# EAGLE schematic msgeq7-simple (EAGLE 6.5.0)
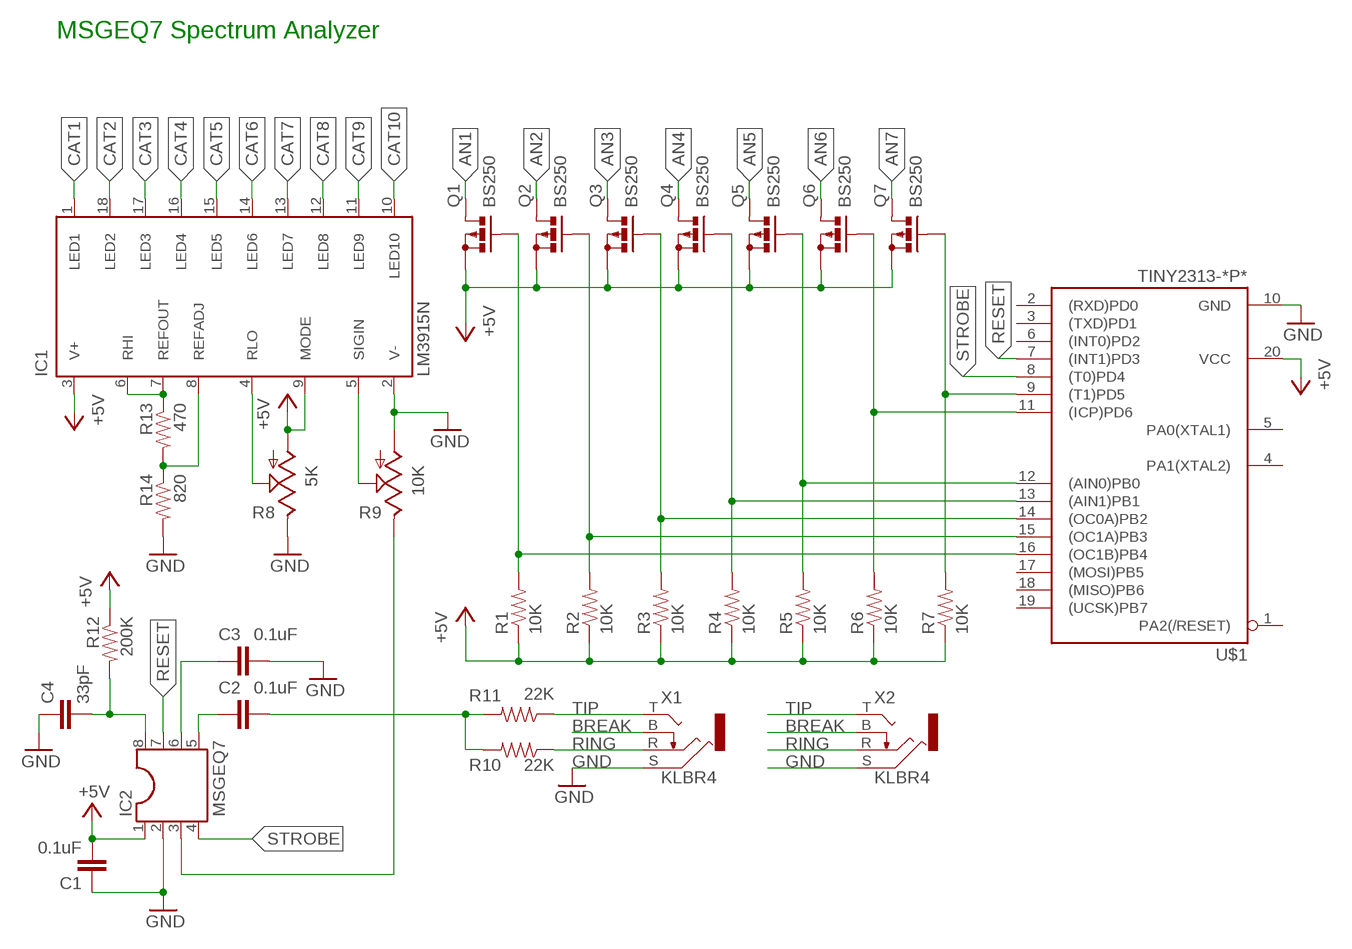
[diagram p0: schematic, sheet 1]

## Parts
C1  0.1uF  CAPPTH  [CAP-PTH-SMALL]
C2  0.1uF  CAPPTH  [CAP-PTH-SMALL]
C3  0.1uF  CAPPTH  [CAP-PTH-SMALL]
C4  33pF  CAPPTH  [CAP-PTH-SMALL]
IC1  LM3915N  [DIL18]
IC2  MSGEQ7  DIL8  [DIL08]
Q1  BS250  [SOT54E]
Q2  BS250  [SOT54E]
Q3  BS250  [SOT54E]
Q4  BS250  [SOT54E]
Q5  BS250  [SOT54E]
Q6  BS250  [SOT54E]
Q7  BS250  [SOT54E]
R1  10K  RESISTORPTH-1/4W  [AXIAL-0.4]
R2  10K  RESISTORPTH-1/4W  [AXIAL-0.4]
R3  10K  RESISTORPTH-1/4W  [AXIAL-0.4]
R4  10K  RESISTORPTH-1/4W  [AXIAL-0.4]
R5  10K  RESISTORPTH-1/4W  [AXIAL-0.4]
R6  10K  RESISTORPTH-1/4W  [AXIAL-0.4]
R7  10K  RESISTORPTH-1/4W  [AXIAL-0.4]
R8  5K  TRIM_US-LI10  [LI10]
R9  10K  TRIM_US-LI10  [LI10]
R10  22K  RESISTORPTH-1/4W  [AXIAL-0.4]
R11  22K  RESISTORPTH-1/4W  [AXIAL-0.4]
R12  200K  RESISTORPTH-1/4W  [AXIAL-0.4]
R13  470  RESISTORPTH-1/4W  [AXIAL-0.4]
R14  820  RESISTORPTH-1/4W  [AXIAL-0.4]
U$1  TINY2313-*P*  [DIL20]
X1  KLBR4  [KLBR4]
X2  KLBR4  [KLBR4]

## Nets
+5V: C1.2 IC1.3(V+) IC1.9(MODE) IC2.1 Q1.S Q2.S Q3.S Q4.S Q5.S Q6.S Q7.S R1.P$1 R2.P$1 R3.P$1 R4.P$1 R5.P$1 R6.P$1 R7.P$1 R8.A R12.P$1 U$1.20(VCC)
AN1: Q1.D
AN2: Q2.D
AN3: Q3.D
AN4: Q4.D
AN5: Q5.D
AN6: Q6.D
AN7: Q7.D
BREAK: X1.B X2.B
CAT1: IC1.1(LED1)
CAT2: IC1.18(LED2)
CAT3: IC1.17(LED3)
CAT4: IC1.16(LED4)
CAT5: IC1.15(LED5)
CAT6: IC1.14(LED6)
CAT7: IC1.13(LED7)
CAT8: IC1.12(LED8)
CAT9: IC1.11(LED9)
CAT10: IC1.10(LED10)
GND: C1.1 C3.1 C4.1 IC1.2(V-) IC2.2 R8.E R9.A R14.P$2 U$1.10(GND) X1.S X2.S
N$1: Q1.G R1.P$2 U$1.16((OC1B)PB4)
N$2: Q2.G R2.P$2 U$1.15((OC1A)PB3)
N$3: Q3.G R3.P$2 U$1.14((OC0A)PB2)
N$4: Q4.G R4.P$2 U$1.13((AIN1)PB1)
N$5: Q5.G R5.P$2 U$1.12((AIN0)PB0)
N$6: Q6.G R6.P$2 U$1.11((ICP)PD6)
N$7: Q7.G R7.P$2 U$1.9((T1)PD5)
N$9: IC1.4(RLO) R8.S
N$10: C2.2 IC2.5
N$11: IC2.3 R9.E
N$12: IC1.5(SIGIN) R9.S
N$13: C2.1 R10.P$2 R11.P$2
N$14: C3.2 IC2.6
N$15: C4.2 IC2.8 R12.P$2
N$16: IC1.6(RHI) IC1.7(REFOUT) R13.P$1
N$17: IC1.8(REFADJ) R13.P$2 R14.P$1
RESET: IC2.7 U$1.7((INT1)PD3)
RING: R10.P$1 X1.R X2.R
STROBE: IC2.4 U$1.8((T0)PD4)
TIP: R11.P$1 X1.T X2.T
Unconnected: U$1.1(PA2(/RESET)) U$1.2((RXD)PD0) U$1.3((TXD)PD1) U$1.4(PA1(XTAL2)) U$1.5(PA0(XTAL1)) U$1.6((INT0)PD2) U$1.17((MOSI)PB5) U$1.18((MISO)PB6) U$1.19((UCSK)PB7)

## Notes on the sheet
- MSGEQ7 Spectrum Analyzer

## Library data of the parts
C1-C4 = SparkFun-Capacitors:CAP: Capacitor Standard 0603 ceramic capacitor, and 0.1" leaded capacitor.
IC1 = national-semiconductor:LM391: Dot/Bar Display Driver Source: Data sheet LM3915 <http://www.national.com/ds/LM/LM3915.pdf> Data sheet LM3914 <http://www.national.com/ds/LM/LM3914.pdf>
IC2 = ic-package:DIL8: Dual In Line / Socket
Q1-Q7 = transistor-small-signal:BS250: P-CHANNEL MOS FET
R1-R7 R10-R14 = SparkFun-Passives:RESISTOR: Resistor Basic schematic elements and footprints for 0603, 1206, and PTH resistors.
R8 R9 = pot:TRIM_US-: POTENTIOMETER
U$1 = avr-7:TINY2313*: Atmel Tiny2313 2K Flash, 128 bytes EEPROM, 128 bytes RAM
X1 X2 = ubiyubix:KLBR4